# EasyEDA Pro project EasyEDA.epro

# Schematic Schematic1_1
Board Name: Board1_1; Create Date: 2025-07-24; Page Name: P1; Project Name: FM_Transmitter_V2; Schematic Name: Schematic1_1; Update Date: 2025-07-27; Company: EasyEDA.com; Page Size: A4; Version: V1.0
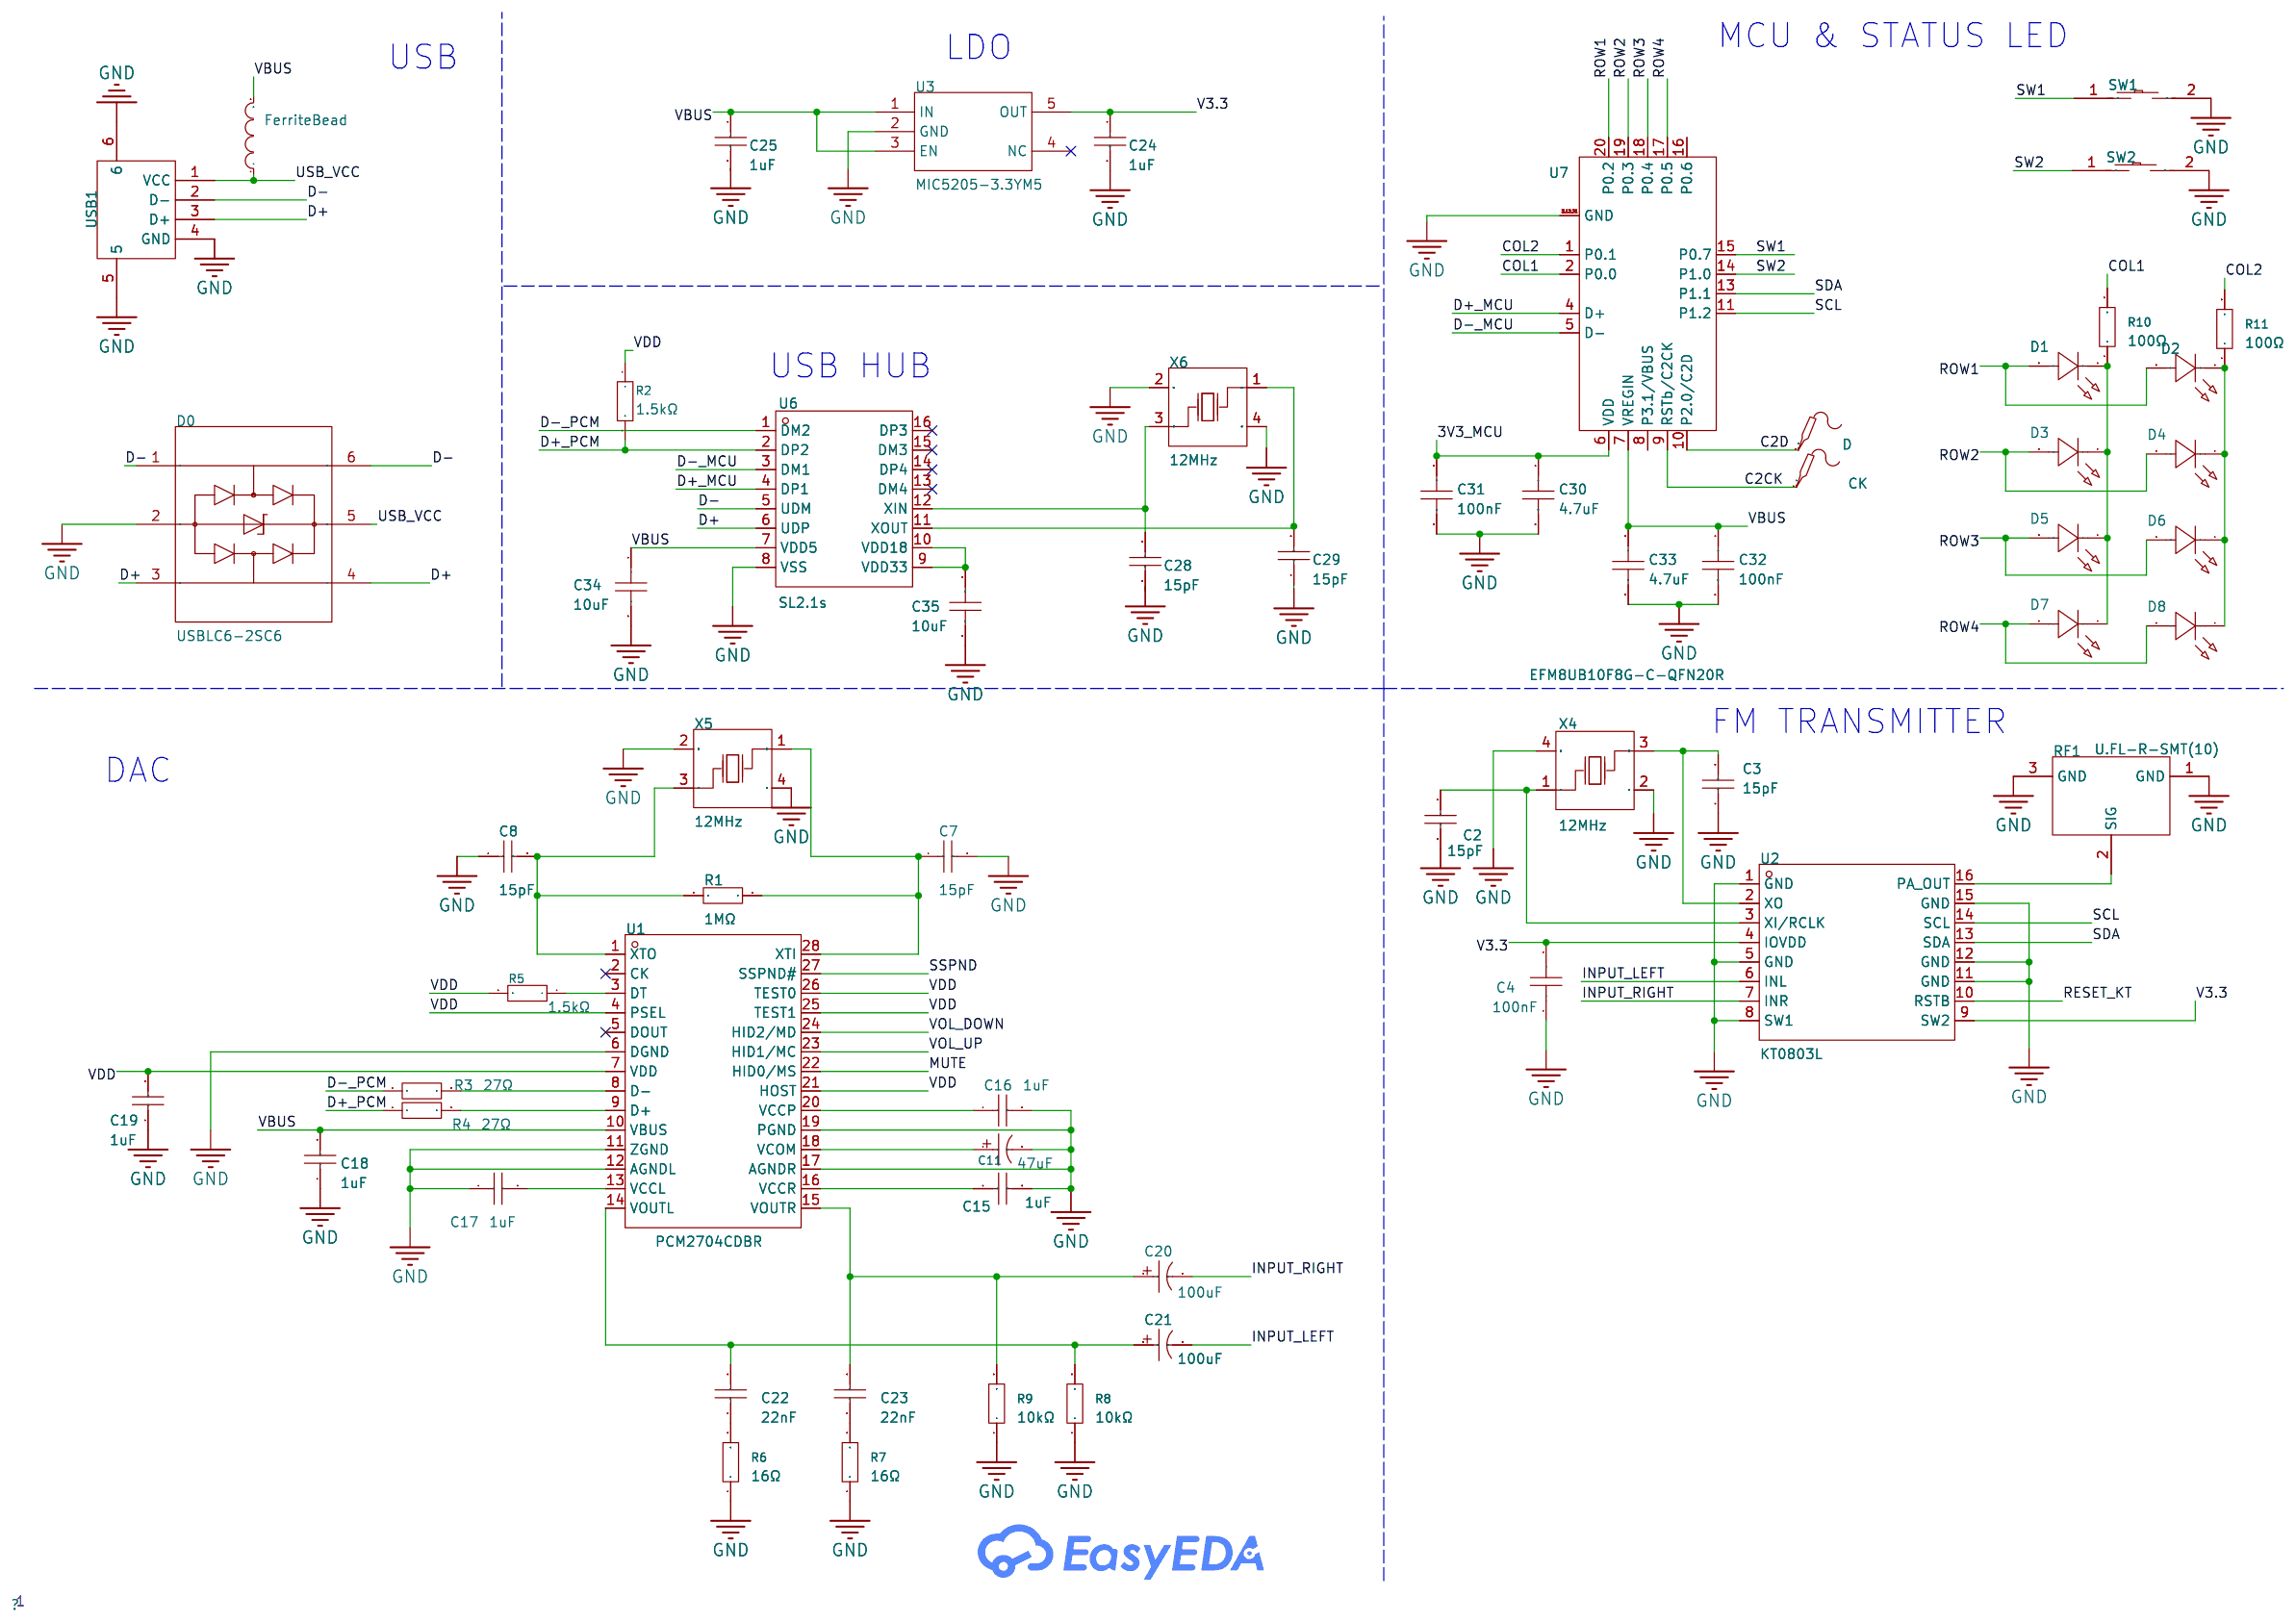
[diagram p0: schematic sheet]

## Parts
C2  15pF  [C0402]
C3  15pF  [C0402]
C4  100nF  [C0402]
C7  15pF  [C0402]
C8  15pF  [C0402]
C11  47uF  [CAP-SMD_BD5.0-L5.3-W5.3-FD]
C15  1uF  [C0402]
C16  1uF  [C0402]
C17  1uF  [C0402]
C18  1uF  [C0402]
C19  1uF  [C0402]
C20  100uF  [CAP-SMD_BD5.0-L5.3-W5.3-RD]
C21  100uF  [CAP-SMD_BD5.0-L5.3-W5.3-RD]
C22  22nF  [C0402]
C23  22nF  [C0402]
C24  1uF  [C0402]
C25  1uF  [C0402]
C28  15pF  [C0402]
C29  15pF  [C0402]
C30  4.7uF  [C0402]
C31  100nF  [C0402]
C32  100nF  [C0402]
C33  4.7uF  [C0402]
C34  10uF  [C0402]
C35  10uF  [C0402]
CK  -  [Test-Point-0.5mm]
D  -  [Test-Point-0.5mm]
D0  USBLC6-2SC6  [SOT-23-6_L2.9-W1.6-P0.95-LS2.8-BL]
D1  XL-1005UGC  [LED0402-RD_GREEN]
D2  XL-1005UGC  [LED0402-RD_GREEN]
D3  XL-1005UGC  [LED0402-RD_GREEN]
D4  XL-1005UGC  [LED0402-RD_GREEN]
D5  XL-1005UGC  [LED0402-RD_GREEN]
D6  XL-1005UGC  [LED0402-RD_GREEN]
D7  XL-1005UGC  [LED0402-RD_GREEN]
D8  XL-1005UGC  [LED0402-RD_GREEN]
FerriteBead  MPZ2012S601AT000  [L0805]
R1  1MΩ  [R0402]
R2  1.5kΩ  [R0402]
R3  27Ω  [R0402]
R4  27Ω  [R0402]
R5  1.5kΩ  [R0402]
R6  16Ω  [R0402]
R7  16Ω  [R0402]
R8  10kΩ  [R0402]
R9  10kΩ  [R0402]
R10  100Ω  [R0402]
R11  100Ω  [R0402]
RF1  U.FL-R-SMT(10)  [ANT-SMD_UFL-R-SMT01]
SW1  B3U-1000P  [KEY-SMD_B3U-1000PM]
SW2  B3U-1000P  [KEY-SMD_B3U-1000PM]
U1  PCM2704CDBR  [SSOP-28_L10.2-W5.3-P0.65-LS7.8-BL]
U2  KT0803L  [SOP-16_L9.9-W3.9-P1.27-LS6.0-BL]
U3  MIC5205-3.3YM5  [SOT-23-5_L2.9-W1.6-P0.95-LS2.8-BR]
U6  SL2.1s  [SSOP-16_L4.6-W2.6-P0.53-LS4.0-BL]
U7  EFM8UB10F8G-C-QFN20R  [QFN-20_L3.0-W3.0-P0.50-TL-EP1.7_SILICON_C8051F85X]
USB1  U-G-O4DD-W-1  [USB-A-TH_U-G-04WD-W-01]
X4  12MHz  [CRYSTAL-SMD_4P-L2.5-W2.0-BL-A]
X5  12MHz  [CRYSTAL-SMD_4P-L2.5-W2.0-BL-A]
X6  12MHz  [CRYSTAL-SMD_4P-L2.5-W2.0-BL-A]

## Library data of the parts
C2 C3 C7 C28 C29 = 0402CG150J500NT: Capacitance: Tolerance:±5% Tolerance:±5% Voltage Rated: Temperature Coefficient:; LCSC Part Name: 15pF ±5% 50V; Supplier Part: C1548; Manufacturer: FH(风华); Supplier Footprint: 0402; JLCPCB Part Class: Basic Part; Datasheet: https://atta.szlcsc.com/upload/public/pdf/source/20200305/C486355_26A10D38EF8C2A5C37091D0039909270.pdf; Supplier: LCSC; Tolerance: ±5%
C4 = CL05B104KO5NNNC: Capacitance: Tolerance:±10% Tolerance:±10% Voltage Rated: Temperature Coefficient:; LCSC Part Name: 100nF ±10% 16V; Supplier Part: C1525; Manufacturer: SAMSUNG(三星); Supplier Footprint: 0402; JLCPCB Part Class: Basic Part; Datasheet: https://atta.szlcsc.com/upload/public/pdf/source/20160218/1457707763339.pdf; Supplier: LCSC; Tolerance: ±10%
C8 = GJM1555C1H150FB01D: Capacitance: Tolerance:±1% Tolerance:±1% Voltage Rated: Temperature Coefficient:; LCSC Part Name: 15pF ±1% 50V; Supplier Part: C441742; Manufacturer: muRata(村田); Supplier Footprint: 0402; JLCPCB Part Class: Extended Part; Datasheet: https://atta.szlcsc.com/upload/public/pdf/source/20200305/C490387_23319AE8C154DEB24C505E6C82A8106A.pdf; Supplier: LCSC; Tolerance: ±1%
C11 = RVT1C470M0505: Capacitance: Tolerance:±20% Tolerance:±20% Rated Voltage: Ripple Current:- Equivalent Series Resistance(ESR):- φD: L: Lifetime @ Temp:2000hrs@105℃ Operating Temperature:-55℃~+105℃ Operating Temperature:-55℃~+105℃; LCSC Part Name: 47uF ±20% 16V; Supplier Part: C3337; Manufacturer: HONOR(荣誉); Supplier Footprint: SMD,D5xL5.4mm; JLCPCB Part Class: Extended Part; Datasheet: https://atta.szlcsc.com/upload/public/pdf/source/20170602/1496384426683.pdf; Supplier: LCSC; Tolerance: ±20%; Lifetime @ Temp: 2000hrs@105℃; Operating Temperature: -55℃~+105℃
C15-C19 C24 C25 = CL05A105KP5NNNC: Capacitance: Tolerance:±10% Tolerance:±10% Voltage Rated: Temperature Coefficient:; LCSC Part Name: 1uF ±10% 10V; Supplier Part: C14445; Manufacturer: SAMSUNG(三星); Supplier Footprint: 0402; JLCPCB Part Class: Extended Part; Datasheet: https://atta.szlcsc.com/upload/public/pdf/source/20160218/1457707763339.pdf; Supplier: LCSC; Tolerance: ±10%
C20 C21 = FVH010ADA101M0554: Capacitance:100uF Tolerance:±20% Tolerance:±20% Voltage Rating:10V Operating Temperature:-55℃~+105℃ Operating Temperature:-55℃~+105℃; LCSC Part Name: 100uF ±20% 10V 宽温品; Supplier Part: C7469983; Manufacturer: FOSAN(富捷/富信); Supplier Footprint: 5x5.4; JLCPCB Part Class: Extended Part; Datasheet: https://atta.szlcsc.com/upload/public/pdf/source/20230725/F0E937D26738F08AA89B969080CCF08D.pdf; Supplier: LCSC; Tolerance: ±20%; Voltage Rating: 10V; Operating Temperature: -55℃~+105℃
C22 C23 = 0402B223K500NT: Capacitance:22nF Tolerance:±10% Tolerance:±10% Voltage Rating:50V Temperature Coefficient:X7R; LCSC Part Name: 22nF ±10% 50V; Supplier Part: C1532; Manufacturer: FH(风华); Supplier Footprint: 0402; Datasheet: https://atta.szlcsc.com/upload/public/pdf/source/20200305/C486355_26A10D38EF8C2A5C37091D0039909270.pdf; Supplier: LCSC; Tolerance: ±10%; Voltage Rating: 50V; Temperature Coefficient: X7R
C30 C33 = CL05A475KP5NRNC: Capacitance: Tolerance:±10% Tolerance:±10% Voltage Rated: Temperature Coefficient:; LCSC Part Name: 4.7uF ±10% 10V; Supplier Part: C368809; Manufacturer: SAMSUNG(三星); Supplier Footprint: 0402; JLCPCB Part Class: Extended Part; Datasheet: https://atta.szlcsc.com/upload/public/pdf/source/20160218/1457707763339.pdf; Supplier: LCSC; Tolerance: ±10%
C31 C32 = CL05A104KA5NNNC: Capacitance: Tolerance:±10% Tolerance:±10% Voltage Rated: Temperature Coefficient:; LCSC Part Name: 100nF ±10% 25V; Supplier Part: C100072; Manufacturer: SAMSUNG(三星); Supplier Footprint: 0402; JLCPCB Part Class: Extended Part; Datasheet: https://atta.szlcsc.com/upload/public/pdf/source/20160218/1457707763339.pdf; Supplier: LCSC; Tolerance: ±10%
C34 C35 = CAP_0402: Supplier Part: C1525; Supplier Footprint: 0402
CK D = Test-Point: Test Point 测试点
D0 = USBLC6-2SC6: Reverse Stand-Off Voltage (Vrwm):5V Maximum Clamping Voltage:20V Peak Pulse Current (Ipp)@10/1000us:5A Breakdown Voltage:6V Type:ESD; LCSC Part Name: ESD二极管 USBLC6-2SC6; Supplier Part: C323793; Supplier Footprint: SOT-23-6; JLCPCB Part Class: Extended Part; Datasheet: https://atta.szlcsc.com/upload/public/pdf/source/20181029/C323793_48F7908330A3F84485333C8DC43F9E49.pdf; Supplier: LCSC; Reverse Stand-Off Voltage (Vrwm): 5V; Maximum Clamping Voltage: 20V; Peak Pulse Current (Ipp)@10/1000us: 5A; Breakdown Voltage: 6V; Type: ESD
D1-D8 = XL-1005UGC_C965793: Emitted Color:Emerald Forward Voltage (VF):3V Forward Voltage (VF):3V Power Dissipation:80mW Forward Current:25mA Dominant Wavelength:516nm~531nm Dominant Wavelength:516nm~531nm Peak Wavelength:531nm Lens Color:Colorless Transparent Lens Color Temperature; Supplier Part: C965793; Manufacturer: XINGLIGHT(成兴光); Supplier Footprint: 0402; JLCPCB Part Class: Extended Part; Datasheet: https://atta.szlcsc.com/upload/public/pdf/source/20201230/C965793_0CDDD21E721E0FD2A4CEAFDFDBC3C135.pdf; Supplier: LCSC; Emitted Color: Emerald; Forward Voltage (VF): 3V; Power Dissipation: 80mW; Forward Current: 25mA; Dominant Wavelength: 516nm~531nm; Peak Wavelength: 531nm; Lens Color: Colorless Transparent Lens; Luminous Intensity: 249mcd; Viewing Angle: 120°; Mounting Sytle: Positive Stick; Operating Temperature: -30℃~+85℃
FerriteBead = MPZ2012S601AT000: Impedance @ Frequency:600Ω@100MHz Tolerance:±25% Tolerance:±25% DC Resistance:100mΩ Current Rating:2A Circuits:1; LCSC Part Name: 单路 0805磁珠 阻抗600Ω@100MHz; Supplier Part: C21519; Manufacturer: TDK; Supplier Footprint: 0805; JLCPCB Part Class: Extended Part; Datasheet: https://atta.szlcsc.com/upload/public/pdf/source/20141219/1457707252380.pdf; Supplier: LCSC; Impedance @ Frequency: 600Ω@100MHz; Tolerance: ±25%; DC Resistance: 100mΩ; Current Rating: 2A; Circuits: 1
R1 = 0402WGF1004TCE: Type:Thick Film Resistors Resistance:1MΩ Tolerance:±1% Tolerance:±1% Power(Watts): Overload Voltage (Max): Temperature Coefficient:±100ppm/℃ Temperature Coefficient:±100ppm/℃ Operating Temperature Range:-55℃~+155℃ Operating Temperature Range:-55℃~+155℃; LCSC Part Name: 1MΩ ±1% 62.5mW 厚膜电阻; Supplier Part: C26083; Manufacturer: UNI-ROYAL(厚声); Supplier Footprint: 0402; JLCPCB Part Class: Basic Part; Datasheet: https://atta.szlcsc.com/upload/public/pdf/source/20200306/C422600_1E6D84923E4A46A82E41ADD87F860B5C.pdf; Supplier: LCSC; Type: Thick Film Resistors; Tolerance: ±1%; Temperature Coefficient: ±100ppm/℃; Operating Temperature Range: -55℃~+155℃
R2 R5 = 0402WGF1501TCE: Type:Thick Film Resistors Resistance:1.5kΩ Tolerance:±1% Tolerance:±1% Power(Watts): Overload Voltage (Max): Temperature Coefficient:±100ppm/℃ Temperature Coefficient:±100ppm/℃ Operating Temperature Range:-55℃~+155℃ Operating Temperature Range:-55℃~+155℃; LCSC Part Name: 1.5kΩ ±1% 62.5mW 厚膜电阻; Supplier Part: C25867; Manufacturer: UNI-ROYAL(厚声); Supplier Footprint: 0402; JLCPCB Part Class: Basic Part; Datasheet: https://atta.szlcsc.com/upload/public/pdf/source/20200306/C422600_1E6D84923E4A46A82E41ADD87F860B5C.pdf; Supplier: LCSC; Type: Thick Film Resistors; Tolerance: ±1%; Temperature Coefficient: ±100ppm/℃; Operating Temperature Range: -55℃~+155℃
R3 R4 = 0402WGF270JTCE: Type:Thick Film Resistors Resistance:27Ω Tolerance:±1% Tolerance:±1% Power(Watts): Overload Voltage (Max): Temperature Coefficient:±100ppm/℃ Temperature Coefficient:±100ppm/℃ Operating Temperature Range:-55℃~+155℃ Operating Temperature Range:-55℃~+155℃; LCSC Part Name: 27Ω ±1% 62.5mW 厚膜电阻; Supplier Part: C25100; Manufacturer: UNI-ROYAL(厚声); Supplier Footprint: 0402; JLCPCB Part Class: Extended Part; Datasheet: https://atta.szlcsc.com/upload/public/pdf/source/20200306/C422600_1E6D84923E4A46A82E41ADD87F860B5C.pdf; Supplier: LCSC; Type: Thick Film Resistors; Tolerance: ±1%; Temperature Coefficient: ±100ppm/℃; Operating Temperature Range: -55℃~+155℃
R6 R7 = FRC0402F16R0TS: Type:Thick Film Resistors Resistance: Tolerance:±1% Tolerance:±1% Power(Watts): Overload Voltage (Max): Temperature Coefficient:±100ppm/℃ Temperature Coefficient:±100ppm/℃ Operating Temperature Range:-55℃~+155℃ Operating Temperature Range:-55℃~+155℃; LCSC Part Name: 16Ω ±1% 62.5mW 厚膜电阻; Supplier Part: C2909324; Manufacturer: FOJAN(富捷); Supplier Footprint: 0402; JLCPCB Part Class: Extended Part; Datasheet: https://atta.szlcsc.com/upload/public/pdf/source/20211221/925EC7D7225764EE0046F22065062C87.pdf; Supplier: LCSC; Type: Thick Film Resistors; Tolerance: ±1%; Temperature Coefficient: ±100ppm/℃; Operating Temperature Range: -55℃~+155℃
R8 R9 = 0402WGJ0103TCE: Type:Thick Film Resistors Resistance:10kΩ Tolerance:±5% Tolerance:±5% Power(Watts): Overload Voltage (Max): Temperature Coefficient:±100ppm/℃ Temperature Coefficient:±100ppm/℃ Operating Temperature Range:-55℃~+155℃ Operating Temperature Range:-55℃~+155℃; LCSC Part Name: 10kΩ ±5% 62.5mW 厚膜电阻; Supplier Part: C25531; Manufacturer: UNI-ROYAL(厚声); Supplier Footprint: 0402; JLCPCB Part Class: Extended Part; Datasheet: https://atta.szlcsc.com/upload/public/pdf/source/20200306/C422600_1E6D84923E4A46A82E41ADD87F860B5C.pdf; Supplier: LCSC; Type: Thick Film Resistors; Tolerance: ±5%; Temperature Coefficient: ±100ppm/℃; Operating Temperature Range: -55℃~+155℃
R10 R11 = FRC0402F1000TS: Type:Thick Film Resistors Resistance: Tolerance:±1% Tolerance:±1% Power(Watts): Overload Voltage (Max): Temperature Coefficient:±100ppm/℃ Temperature Coefficient:±100ppm/℃ Operating Temperature Range:-55℃~+155℃ Operating Temperature Range:-55℃~+155℃; LCSC Part Name: 100Ω ±1% 62.5mW 厚膜电阻; Supplier Part: C2906860; Manufacturer: FOJAN(富捷); Supplier Footprint: 0402; JLCPCB Part Class: Extended Part; Datasheet: https://atta.szlcsc.com/upload/public/pdf/source/20211221/925EC7D7225764EE0046F22065062C87.pdf; Supplier: LCSC; Type: Thick Film Resistors; Tolerance: ±1%; Temperature Coefficient: ±100ppm/℃; Operating Temperature Range: -55℃~+155℃
RF1 = U.FL-R-SMT(10): Connector Type:板端 Interface Type:内针 Number of Ports:1 Interface Diameter:2mm Interface Length/Height:1.25mm Frequency-Max:6GHz RF Series:IPEX Impedance:50Ω Style:- Contact Material:Brass Operating Temperature Range:-40℃~+90℃ Operating Temperature Range:-4; LCSC Part Name: IPEX 内针; Supplier Part: C434808; Manufacturer: HRS(广濑); Supplier Footprint: SMD; JLCPCB Part Class: Extended Part; Datasheet: https://atta.szlcsc.com/upload/public/pdf/source/20191010/C434816_11DAC26C7ED37A2D3E584E7DBDF6972E.pdf; Supplier: LCSC; Connector Type: 板端; Interface Type: 内针; Number of Ports: 1; Interface Diameter: 2mm; Interface Length/Height: 1.25mm; Frequency-Max: 6GHz; RF Series: IPEX; Impedance: 50Ω; Contact Material: Brass; Operating Temperature Range: -40℃~+90℃
SW1 SW2 = B3U-1000P_C231329: Circuit:SPST Actuator Style:Round Button Operating Force:153gf Mounting Style:Standing paste Switch Length:3mm Switch Width:2.5mm Switch Height:1.6mm Contact Current:50mA Voltage Rating (DC):12V With Lamp:- Pin Style:SMDSplicing Mechanical Life:- Operatin; LCSC Part Name: 3*2.5*1.6mm 立贴 轻触开关; Supplier Part: C231329; Manufacturer: OMRON(欧姆龙); Supplier Footprint: SMD,2.5x3mm; JLCPCB Part Class: Extended Part; Supplier: LCSC; Circuit: SPST; Actuator Style: Round Button; Operating Force: 153gf; Mounting Style: Standing paste; Switch Length: 3mm; Switch Width: 2.5mm; Switch Height: 1.6mm; Contact Current: 50mA; Voltage Rating (DC): 12V; Pin Style: SMDSplicing; Operating Temperature: -25℃~+70℃
U1 = PCM2704CDBR: Resolution:16 Number of Channels:- Voltage - Supply:3V~5.25V Voltage - Supply:3V~5.25V Interface Type:USB；SPI Operating Temperature:-25℃~+85℃ Operating Temperature:-25℃~+85℃; Supplier Part: C2859784; Manufacturer: TI(德州仪器); Supplier Footprint: SSOP-28-208mil; JLCPCB Part Class: Extended Part; Datasheet: https://www.ti.com/cn/lit/gpn/pcm2706c; Supplier: LCSC; Resolution: 16; Voltage - Supply: 3V~5.25V; Interface Type: USB；SPI; Operating Temperature: -25℃~+85℃
U2 = KT0803L: Supplier Part: C9900105795; Supplier Footprint: SOP16; JLCPCB Part Class: Extended Part; Supplier: LCSC
U3 = MIC5205-3.3YM5: Output Type:Fixed Voltage - Supply:20V Output Voltage:3.3V Output Voltage:3.3V Output Current:150mA Power Supply Rejection Ratio (PSRR):70dB@(1kHz) Operating Temperature:-40℃~+125℃@(Tj) Operating Temperature:-40℃~+125℃@(Tj) Output Configuration:Positive e; LCSC Part Name: 线性稳压器(LDO); Supplier Part: C20617303; Manufacturer: TECH PUBLIC(台舟); Supplier Footprint: SOT-23-5; JLCPCB Part Class: Extended Part; Datasheet: https://atta.szlcsc.com/upload/public/pdf/source/20240202/BF02EA9B20BC582DB45A13FA3EA98D4D.pdf; Supplier: LCSC; Output Type: Fixed; Voltage - Supply: 20V; Output Voltage: 3.3V; Output Current: 150mA; Power Supply Rejection Ratio (PSRR): 70dB@(1kHz); Operating Temperature: -40℃~+125℃@(Tj); Output Configuration: Positive electrode; Number of Outputs: 1
U6 = SL2.1s: Supplier Part: C2684433; Manufacturer: CoreChips(和芯润德); Supplier Footprint: SSOP-16-2.6mm; Datasheet: https://atta.szlcsc.com/upload/public/pdf/source/20210326/C2684433_0308B0C984AD3FC6CBDA43F1CDB06B3F.pdf; Supplier: LCSC
U7 = EFM8UB10F8G-C-QFN20R: CPU Core:51Series Program Storage Size:8KB RAM Size:2.25KB GPIO Ports Number:13 Operating Voltage Range:1.71V~3.6V Operating Voltage Range:1.71V~3.6V CPU Maximum Speed:50MHz Program Memory Type:FLASH Operating Temperature Range:-40℃~+85℃ Operating Tempera; Supplier Part: C2055590; Manufacturer: SKYWORKS/SILICON LABS(芯科); Supplier Footprint: QFN-20-EP(3x3); Datasheet: https://atta.szlcsc.com/upload/public/pdf/source/20210702/AAB6029825307DEA1E2C140C782B19C1.pdf; Supplier: LCSC; CPU Core: 51Series; Program Storage Size: 8KB; RAM Size: 2.25KB; GPIO Ports Number: 13; Operating Voltage Range: 1.71V~3.6V; CPU Maximum Speed: 50MHz; Program Memory Type: FLASH; Operating Temperature Range: -40℃~+85℃; ADC (Bit): 12bit; Peripheral/Function: Watchdog; Watchdog: Yes; Internal Oscillator: Yes
USB1 = U-G-O4DD-W-1: Connector Type:Type-A Standard:USB 2.0 Gender:公 Number of Ports:1 Number of Contacts:4P Current Rating - Power (Max):1A; LCSC Part Name: Type-A 公; Supplier Part: C98125; Manufacturer: 韩国韩荣; Supplier Footprint: 插件; JLCPCB Part Class: Extended Part; Datasheet: https://atta.szlcsc.com/upload/public/pdf/source/20190321/C98125_6153EFB71EE46DEADFAFF2A82C946B59.pdf; Supplier: LCSC; Connector Type: Type-A; Standard: USB 2.0; Gender: 公; Number of Ports: 1; Number of Contacts: 4P; Current Rating - Power (Max): 1A
X4-X6 = SX2B12.000F1010F30: Type:Crystal Oscillator Frequency:12MHz Normal temperature Frequency Tolerance:±10ppm Normal temperature Frequency Tolerance:±10ppm Load Capacitance:10pF Frequency Stability:±30ppm Frequency Stability:±30ppm Equivalent Series Resistance(ESR):200Ω Operatin; LCSC Part Name: 12MHz ±10ppm 10pF; Supplier Part: C7301971; Manufacturer: SCTF(星通时频); Supplier Footprint: SMD2520-4P; JLCPCB Part Class: Extended Part; Datasheet: https://atta.szlcsc.com/upload/public/pdf/source/20240418/57769B85D7CD97C84A424B0AE31F5144.pdf; Supplier: LCSC; Type: Crystal Oscillator; Normal temperature Frequency Tolerance: ±10ppm; Load Capacitance: 10pF; Frequency Stability: ±30ppm; Equivalent Series Resistance(ESR): 200Ω; Operating Temperature: -40℃~+85℃

## Nets
3V3_MCU: C30.1 C31.1 U7.6(VDD)
GND: C2.1 C3.1 C4.1 C7.2 C8.1 C11.2 C15.2 C16.2 C17.1 C18.1 C19.1 C24.2 C25.2 C28.1 C29.1 C30.2 C31.2 C32.2 C33.2 C34.2 C35.2 D0.2 R6.1 R7.1 R8.1 R9.1 RF1.1(GND) RF1.3(GND) SW1.2 SW2.2 U1.6(DGND) U1.11(ZGND) U1.12(AGNDL) U1.17(AGNDR) U1.19(PGND) U2.1(GND) U2.5(GND) U2.8(SW1) U2.11(GND) U2.12(GND) U2.15(GND) U3.2(GND) U6.8(VSS) U7.3,12,21(GND) USB1.4(GND) USB1.5 USB1.6 X4.2(GND) X4.4(GND) X5.2(GND) X5.4(GND) X6.2(GND) X6.4(GND)
V3.3: C4.2 C24.1 U2.4(IOVDD) U2.9(SW2) U3.5(OUT)
VBUS: C18.2 C25.1 C32.1 C33.1 C34.1 FerriteBead.2 U1.10(VBUS) U3.1(IN) U3.3(EN) U6.7(VDD5) U7.7(VREGIN)
VDD: C19.2 R2.1 R5.2 U1.4(PSEL) U1.7(VDD) U1.21(HOST) U1.25(TEST1) U1.26(TEST0)
C2CK: CK.1 U7.9(RSTb/C2CK)
C2D: D.1 U7.10(P2.0/C2D)
COL1: R10.2 U7.2(P0.0)
COL2: R11.2 U7.1(P0.1)
D+: D0.3 D0.4 U6.6(UDP) USB1.3(D+)
D+_MCU: U6.4(DP1) U7.4(D+)
D+_PCM: R2.2 R4.1 U6.2(DP2)
D-: D0.1 D0.6 U6.5(UDM) USB1.2(D-)
D-_MCU: U6.3(DM1) U7.5(D-)
D-_PCM: R3.1 U6.1(DM2)
INPUT_LEFT: C21.2 U2.6(INL)
INPUT_RIGHT: C20.2 U2.7(INR)
MUTE: U1.22(HID0/MS)
RESET_KT: U2.10(RSTB)
ROW1: D1.2(A) D2.2(A) U7.20(P0.2)
ROW2: D3.2(A) D4.2(A) U7.19(P0.3)
ROW3: D5.2(A) D6.2(A) U7.18(P0.4)
ROW4: D7.2(A) D8.2(A) U7.17(P0.5)
SCL: U2.14(SCL) U7.11(P1.2)
SDA: U2.13(SDA) U7.13(P1.1)
SSPND: U1.27(SSPND#)
SW1: SW1.1 U7.15(P0.7)
SW2: SW2.1 U7.14(P1.0)
USB_VCC: D0.5 FerriteBead.1 USB1.1(VCC)
VOL_DOWN: U1.24(HID2/MD)
VOL_UP: U1.23(HID1/MC)
$1N1321: RF1.2(SIG) U2.16(PA_OUT)
$1N1861: C7.1 R1.2 U1.28(XTI) X5.1(OSC1)
$1N1867: C8.2 R1.1 U1.1(XTO) X5.3(OSC2)
$1N2251: C16.1 U1.20(VCCP)
$1N2376: C11.1 U1.18(VCOM)
$1N2424: C15.1 U1.16(VCCR)
$1N2491: C17.2 U1.13(VCCL)
$1N2905: R4.2 U1.9(D+)
$1N2912: R3.2 U1.8(D-)
$1N3054: R5.1 U1.3(DT)
$1N3574: C22.1 R6.2
$1N3613: C23.1 R7.2
$1N3658: C20.1 C23.2 R9.2 U1.15(VOUTR)
$1N3676: C21.1 C22.2 R8.2 U1.14(VOUTL)
$1N27902: C2.2 U2.3(XI/RCLK) X4.1(OSC1)
$1N27931: C3.2 U2.2(XO) X4.3(OSC2)
$1N27996: C29.2 U6.11(XOUT) X6.1(OSC1)
$1N28003: C28.2 U6.12(XIN) X6.3(OSC2)
$1N49869: D1.1(K) D3.1(K) D5.1(K) D7.1(K) R10.1
$1N49876: D2.1(K) D4.1(K) D6.1(K) D8.1(K) R11.1
$1N69021: C35.1 U6.9(VDD33) U6.10(VDD18)

Not connected (* = marked no-connect by the designer): U1 2(CK)* 5(DOUT)*; U3 4(NC)*; U6 13(DM4)* 14(DP4)* 15(DM3)* 16(DP3)*; U7 8(P3.1/VBUS) 16(P0.6)

## Notes on the sheet
- LDO
- MCU & STATUS LED
- USB
- USB HUB
- FM TRANSMITTER
- DAC

# Board PCB1_1
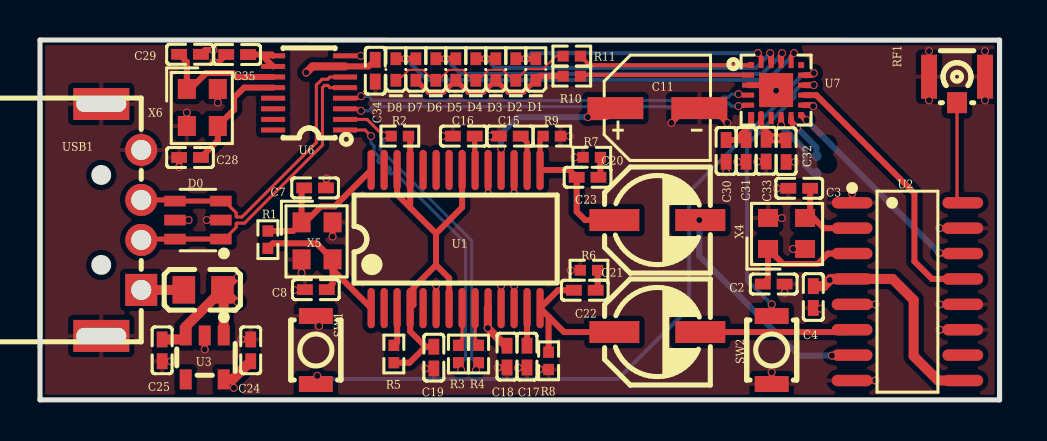
[diagram p1: board, top side]
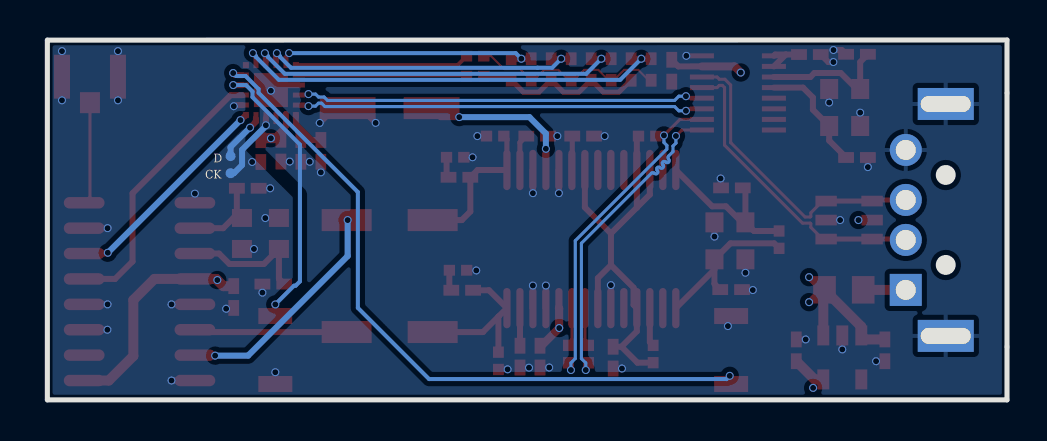
[diagram p2: board, bottom side, seen from below]

Outline 48 x 18 mm; copper layers: Top Layer, Inner1, Inner2, Bottom Layer. Coordinates in mm from the lower left corner of the outline.
Outline path: 0,15.35 0,18 48,17.99 48,0 0,0 0,2.65
Stack: Top Layer 0.035mm Outer layer thickness 1oz / Dielectric1 0.2104mm 7628 RC49% 8.6mil / Inner1 0.0152mm Inner layer thickness / Dielectric2 1.065mm 1.1mm H/HOZ Copper / Inner2 0.0152mm Inner layer thickness / Dielectric3 0.2104mm 7628 RC49% 8.6mil / Bottom Layer 0.035mm Outer layer thickness 1oz

## Design rules (mm)
net $1N2912: DP5
net $1N2905: DP5
net D-: DP1
net D+: DP1
net D+_PCM: DP3
net D-_PCM: DP3
net D-_MCU: DP4
net D+_MCU: DP4
template: Custom Config
spacing copperThickness1oz (default): track to track 0.102, other pairs 0.152 to 0.3
spacing copperThickness2oz: track to track 0.203, other pairs 0.152 to 0.3
track width copperThickness1oz: min 0.1, default 0.2, max 5
track width copperThickness2oz: min 0.203, default 0.254, max 2.54
track width trackWidth1 (default): min 0.1, default 0.3, max 2.54
differential pair differentialPair (default): width min 0.127, default 0.155, max 2.54; gap min 0.152, default 0.152
via viaSize (default): diameter min 0.4, default 0.4, max 10; hole min 0.3, default 0.3, max 6.3

## Placement (name value [footprint] x y rotation side)
C2  15pF  [C0402]  36.7 5.79 180 top
C3  15pF  [C0402]  37.98 10.58 0 top
C4  100nF  [C0402]  38.68 5.14 90 top
C7  15pF  [C0402]  13.76 10.6 0 top
C8  15pF  [C0402]  13.8 5.51 0 top
C11  47uF  [CAP-SMD_BD5.0-L5.3-W5.3-FD]  30.88 14.59 0 top
C15  1uF  [C0402]  23.5 13.19 180 top
C16  1uF  [C0402]  21.2 13.19 180 top
C17  1uF  [C0402]  24.36 2.16 90 top
C18  1uF  [C0402]  23.36 2.16 90 top
C19  1uF  [C0402]  19.7 2.11 90 top
C20  100uF  [CAP-SMD_BD5.0-L5.3-W5.3-RD]  30.88 8.99 180 top
C21  100uF  [CAP-SMD_BD5.0-L5.3-W5.3-RD]  30.88 3.39 180 top
C22  22nF  [C0402]  27.25 5.48 180 top
C23  22nF  [C0402]  27.39 11.13 180 top
C24  1uF  [C0402]  10.54 2.48 90 top
C25  1uF  [C0402]  6.11 2.48 270 top
C28  15pF  [C0402]  7.5 12.12 0 top
C29  15pF  [C0402]  7.5 17.28 180 top
C30  4.7uF  [C0402]  34.32 12.45 270 top
C31  100nF  [C0402]  35.32 12.45 270 top
C32  100nF  [C0402]  37.32 12.44 270 top
C33  4.7uF  [C0402]  36.32 12.46 270 top
C34  10uF  [C0402]  16.77 16.46 270 top
C35  10uF  [C0402]  9.86 17.27 180 top
CK  -  [Test-Point-0.5mm]  38.84 11.34 180 bottom
D  -  [Test-Point-0.5mm]  38.84 12.19 180 bottom
D0  USBLC6-2SC6  [SOT-23-6_L2.9-W1.6-P0.95-LS2.8-BL]  7.9 8.99 90 top
D1  XL-1005UGC  [LED0402-RD_GREEN]  24.8 16.52 90 top
D2  XL-1005UGC  [LED0402-RD_GREEN]  23.8 16.52 90 top
D3  XL-1005UGC  [LED0402-RD_GREEN]  22.8 16.52 90 top
D4  XL-1005UGC  [LED0402-RD_GREEN]  21.8 16.52 90 top
D5  XL-1005UGC  [LED0402-RD_GREEN]  20.8 16.52 90 top
D6  XL-1005UGC  [LED0402-RD_GREEN]  19.8 16.52 90 top
D7  XL-1005UGC  [LED0402-RD_GREEN]  18.8 16.52 90 top
D8  XL-1005UGC  [LED0402-RD_GREEN]  17.8 16.52 90 top
FerriteBead  MPZ2012S601AT000  [L0805]  8.16 5.5 0 top
R1  1MΩ  [R0402]  11.4 8.01 90 top
R2  1.5kΩ  [R0402]  18 13.19 180 top
R3  27Ω  [R0402]  20.93 2.29 90 top
R4  27Ω  [R0402]  21.94 2.29 90 top
R5  1.5kΩ  [R0402]  17.7 2.29 270 top
R6  16Ω  [R0402]  27.46 6.48 0 top
R7  16Ω  [R0402]  27.6 12.13 0 top
R8  10kΩ  [R0402]  25.44 1.95 90 top
R9  10kΩ  [R0402]  25.6 13.19 180 top
R10  100Ω  [R0402]  26.6 16.19 0 top
R11  100Ω  [R0402]  26.6 17.19 0 top
RF1  U.FL-R-SMT(10)  [ANT-SMD_UFL-R-SMT01]  45.87 15.51 180 top
SW1  B3U-1000P  [KEY-SMD_B3U-1000PM]  13.8 2.49 90 top
SW2  B3U-1000P  [KEY-SMD_B3U-1000PM]  36.6 2.49 270 top
U1  PCM2704CDBR  [SSOP-28_L10.2-W5.3-P0.65-LS7.8-BL]  20.79 8.04 0 top
U2  KT0803L  [SOP-16_L9.9-W3.9-P1.27-LS6.0-BL]  43.39 5.41 270 top
U3  MIC5205-3.3YM5  [SOT-23-5_L2.9-W1.6-P0.95-LS2.8-BR]  8.24 2.12 90 top
U6  SL2.1s  [SSOP-16_L4.6-W2.6-P0.53-LS4.0-BL]  13.46 15.35 90 top
U7  EFM8UB10F8G-C-QFN20R  [QFN-20_L3.0-W3.0-P0.50-TL-EP1.7_SILICON_C8051F85X]  36.82 15.49 0 top
USB1  U-G-O4DD-W-1  [USB-A-TH_U-G-04WD-W-01]  4.06 9 270 top
X4  12MHz  [CRYSTAL-SMD_4P-L2.5-W2.0-BL-A]  37.34 8.32 0 top
X5  12MHz  [CRYSTAL-SMD_4P-L2.5-W2.0-BL-A]  13.86 7.95 270 top
X6  12MHz  [CRYSTAL-SMD_4P-L2.5-W2.0-BL-A]  8.12 14.62 270 top

## Footprints (pads in the part's own frame, mm; a bottom-side part is the same pattern mirrored in y, then rotated)
ANT-SMD_UFL-R-SMT01
  rect 0.8x2.2 smd: 1(-1.4,-0.65) 3(1.4,-0.65)
  rect 1x1.05 smd: 2(0,0.65)
C0402
  rect 0.79x0.54 smd: 1(-0.545,0) 2(0.545,0)
CAP-SMD_BD5.0-L5.3-W5.3-FD
  rect 2.8x1.1 smd: 1(-2.1,0) 2(2.1,0)
CAP-SMD_BD5.0-L5.3-W5.3-RD
  rect 2.5x1.1 smd: 1(2.15,0) 2(-2.15,0)
CRYSTAL-SMD_4P-L2.5-W2.0-BL-A
  rect 1x0.9 smd: 1(-0.925,-0.775) 2(0.925,-0.775) 3(0.925,0.775) 4(-0.925,0.775)
KEY-SMD_B3U-1000PM
  rect 0.8x1.7 smd: 1(-1.7,0) 2(1.7,0)
L0805
  rect 1.133x1.377 smd: 1(-0.966,0) 2(0.966,0)
LED0402-RD_GREEN
  rect 0.636x0.54 smd: 1(-0.538,0) 2(0.538,0)
QFN-20_L3.0-W3.0-P0.50-TL-EP1.7_SILICON_C8051F85X
  rect 0.3x0.3 smd: 1(-1.25,1.25) 6(-1.25,-1.25) 11(1.25,-1.25) 16(1.25,1.25)
  rect 0.6x0.25 smd: 2(-1.4,0.75) 3(-1.4,0.25) 4(-1.4,-0.25) 5(-1.4,-0.75) 12(1.4,-0.75) 13(1.4,-0.25) 14(1.4,0.25) 15(1.4,0.75)
  rect 0.25x0.6 smd: 7(-0.75,-1.4) 8(-0.25,-1.4) 9(0.25,-1.4) 10(0.75,-1.4) 17(0.75,1.4) 18(0.25,1.4) 19(-0.25,1.4) 20(-0.75,1.4)
  rect 1.7x1.7 smd: 21(-0.001,0)
R0402
  rect 0.566x0.54 smd: 1(-0.433,0) 2(0.433,0)
SOP-16_L9.9-W3.9-P1.27-LS6.0-BL
  oval 0.574x2.038 smd: 1(-4.445,-2.769) 2(-3.175,-2.769) 3(-1.905,-2.769) 4(-0.635,-2.769) 5(0.635,-2.769) 6(1.905,-2.769) 7(3.175,-2.769) 8(4.445,-2.769) 9(4.445,2.769) 10(3.175,2.769) 11(1.905,2.769) 12(0.635,2.769) 13(-0.635,2.769) 14(-1.905,2.769) 15(-3.175,2.769) 16(-4.445,2.769)
SOT-23-5_L2.9-W1.6-P0.95-LS2.8-BR
  rect 1x0.6 smd: 1(1.1,-0.95) 2(1.1,0) 3(1.1,0.95) 4(-1.1,0.95) 5(-1.1,-0.95)
SOT-23-6_L2.9-W1.6-P0.95-LS2.8-BL
  rect 0.532x1.072 smd: 1(-0.95,-1.149) 2(0,-1.149) 3(0.95,-1.149) 4(0.95,1.149) 5(0,1.149) 6(-0.95,1.149)
SSOP-16_L4.6-W2.6-P0.53-LS4.0-BL
  rect 0.25x1.2 smd: 1(-1.855,-1.8) 2(-1.325,-1.8) 3(-0.795,-1.8) 4(-0.265,-1.8) 5(0.265,-1.8) 6(0.795,-1.8) 7(1.325,-1.8) 8(1.855,-1.8) 9(1.855,1.8) 10(1.325,1.8) 11(0.795,1.8) 12(0.265,1.8) 13(-0.265,1.8) 14(-0.795,1.8) 15(-1.325,1.8) 16(-1.855,1.8)
SSOP-28_L10.2-W5.3-P0.65-LS7.8-BL
  oval 0.364x2.015 smd: 1(-4.225,-3.455) 2(-3.575,-3.455) 3(-2.925,-3.455) 4(-2.275,-3.455) 5(-1.625,-3.455) 6(-0.975,-3.455) 7(-0.325,-3.455) 8(0.325,-3.455) 9(0.975,-3.455) 10(1.625,-3.455) 11(2.275,-3.455) 12(2.925,-3.455) 13(3.575,-3.455) 14(4.225,-3.455) 15(4.225,3.455) 16(3.575,3.455) 17(2.925,3.455) 18(2.275,3.455) 19(1.625,3.455) 20(0.975,3.455) 21(0.325,3.455) 22(-0.325,3.455) 23(-0.975,3.455) 24(-1.625,3.455) 25(-2.275,3.455) 26(-2.925,3.455) 27(-3.575,3.455) 28(-4.225,3.455)
Test-Point-0.5mm
  round 0.5 smd: 1(0,0)
USB-A-TH_U-G-04WD-W-01
  rect 1.6x1.6 hole 1: 1(3.5,1)
  round 1.6 hole 1: 2(1,1) 3(-1,1) 4(-3.5,1)
  rect 1.6x2.8 hole 0.8x2.5: 5(5.8,-1) 6(-5.8,-1)

## Nets
As in the schematic, except:
GND: C2.1 C3.1 C4.1 C7.2 C8.1 C11.2 C15.2 C16.2 C17.1 C18.1 C19.1 C24.2 C25.2 C28.1 C29.1 C30.2 C31.2 C32.2 C33.2 C34.2 C35.2 D0.2 R6.1 R7.1 R8.1 R9.1 RF1.1 RF1.3 SW1.2 SW2.2 U1.6 U1.11 U1.12 U1.17 U1.19 U2.1 U2.5 U2.8 U2.11 U2.12 U2.15 U3.2 U6.8 U7.3 U7.12 U7.21 USB1.4 USB1.5 USB1.6 X4.2 X4.4 X5.2 X5.4 X6.2 X6.4

Pads without a net: U1 2 5; U3 4; U6 13 14 15 16; U7 8 16

## Via types
v1: diameter 0.4, hole 0.3, Top Layer to Bottom Layer, 89 vias

## Routing (per net, layer and track width the routed paths; a pad name or vN(x,y) marks a point on that pad's centre or on a via; arc(x,y) is an arc through that point)
3V3_MCU: length 2.6
  Top Layer w0.299: 34.79,13 C31.1 ; 34.79,13 C30.1 ; 34.79,13 35.57,13.78 U7.6
GND: length 34.3
  Top Layer w0.3: C30.2 v1(34.32,11.38) ; C17.1 24.35,1.61 v1(23.91,1.61) ; U7.3 36.57,15.74 U7.21 ; v1(14.32,11.07) 14.32,10.62 C7.2 ; v1(12.72,5.49) 13.24,5.49 C8.1 ; C32.2 v1(37.76,11.9) ; X5.4 v1(14.63,8.17) ; R8.1 25.43,1.53 v1(24.98,1.53) ; v1(45,3.51) U2.11 ; SW2.2 v1(36.6,1.38) ; v1(40.62,10.32) U2.1 ; v1(19.81,5.74) U1.6 ; v1(19.26,1.57) C19.1 ; R9.1 v1(26.49,13.19) ; v1(38.68,14.69) 38.62,14.74 U7.12 ; X4.4 37.09,9.1 v1(37.1,9.09) ; v1(23.72,5.72) U1.12 ; v1(44.99,4.78) U2.12 ; v1(31.58,13.85) 32.32,14.59 C11.2 33.64,14.59 v1(34.38,13.85) ; v1(8.9,14.87) 8.9,15.55 X6.4 ; U1.17 v1(23.72,10.34) ; C35.2 8.94,16.9 v1(8.68,16.9) ; U3.2 v1(8.24,2.52) ; C28.1 v1(6.96,11.64) ; 38.27,7.55 v1(37.67,7.55) ; U1.19 v1(22.41,10.34) ; U2.8 v1(41.79,0.97) ; C31.2 v1(34.88,11.91) ; v1(22.49,13.19) C15.2 ; X5.2 v1(13.08,6.36) ; v1(8.35,8.99) D0.2 ; C33.2 v1(35.88,11.92) ; v1(20.12,13.19) C16.2 ; v1(10.07,3.02) C24.2 ; R7.1 v1(26.73,12.13) ; C25.2 v1(6.55,1.93) ; C2.1 v1(37.25,5.36) ; v1(22.9,1.62) C18.1 ; C29.1 8.27,17.5 v1(8.68,17.5) ; v1(23.06,5.72) U1.11 ; C4.1 39.02,4.6 v1(39.06,4.56) ; v1(36.86,10.58) C3.1 ; v1(7.34,14.37) 7.34,13.7 ; v1(44.99,8.59) U2.15 ; U2.5 v1(41.79,4.78)
  vias: v1(13.96,3.69) v1(16.04,17.21) v1(26.55,6.47) v1(36.82,15.46) v1(44.47,17.44) v1(44.47,14.98) v1(47.27,17.44) v1(47.27,14.98)
V3.3: length 45.1
  Top Layer w0.5: C4.2 39.19,5.69 v1(39.5,5.99) 39.56,6.05 U2.4 42.65,6.05 43.7,4.99 43.7,2.19 44.93,0.97 U2.9 ; C24.1 9.63,1.02 U3.5
  Inner2 w0.5: v1(9.7,0.6) 34.11,0.6 v1(39.5,5.99)
VBUS: length 64.7
  Top Layer w0.3: 9.27,5.5 v1(9.9,6.14) ; 9.27,5.5 FerriteBead.2 ; 9.27,5.5 9.29,5.5 v1(9.9,4.89) ; 36.68,13.08 36.07,13.69 36.07,14.3 ; U6.7 16.44,16.68 C34.1
  Top Layer w0.4: U6.7 13.62,16.68 v1(13.32,16.37) ; C18.2 23.28,2.71 v1(22.4,3.59) 22.4,4.57 U1.10
  Top Layer w0.5: C33.1 36.4,13.08 36.68,13.08 ; C25.1 7.09,3.02 U3.3 7.29,3.67 FerriteBead.2 9.19,5.44 U3.1 ; v1(36.82,13.08) 37.22,13.08 C32.1
  Inner2 w0.5: v1(9.9,4.89) 12.5,2.29 22.15,2.29 22.4,2.55 v1(22.4,3.59) 22.4,7.19 25.4,10.19 35.5,10.19 36.82,11.51 v1(36.82,13.08) ; v1(13.32,16.37) 13.32,13.11 9.9,9.69 v1(9.9,6.14)
VDD: length 22.6
  Top Layer w0.3: 18.51,9.62 U1.25 18.51,13.11 R2.1 ; 18.51,9.62 17.87,10.27 U1.26 ; 18.51,9.62 19.81,8.32 ; U1.7 20.47,6.09 19.81,6.74 ; 19.28,2.66 18.51,3.43 U1.4 18.68,4.75 18.68,5.61 19.81,6.74 ; 19.28,2.66 C19.2 ; 19.28,2.66 18.49,1.86 17.7,1.86 ; 19.81,8.32 21.12,9.63 21.12,11.5 ; 19.81,8.32 19.81,6.74
C2CK: length 3.6
  Top Layer w0.3: U7.9 v1(37.07,13.73)
  Bottom Layer w0.3: v1(37.07,13.73) 37.07,13.7 38.26,12.51 38.26,11.74 38.67,11.34 CK.1
C2D: length 2.4
  Top Layer w0.3: v1(37.87,13.62) 37.57,13.91 37.57,13.94 37.57,13.94 U7.10
  Bottom Layer w0.3: D.1 38.84,12.64 v1(37.87,13.62)
COL1: length 8.4
  Top Layer w0.201: U7.2 27.08,16.24 R10.2
COL2: length 8.7
  Top Layer w0.201: U7.1 27.48,16.74 R11.2
D+: length 15.2
  Top Layer w0.154: D0.3 9.23,9.94 9.81,9.35 9.81,9.18 9.85,9.15 10.1,9.15 13.82,12.87 13.82,15.75 14.11,16.04 14.39,16.04 14.51,16.15 U6.6
  Top Layer w0.254: D0.3 D0.4 6.69,10 USB1.3
D+_MCU: length 20.4
  Top Layer w0.154: U7.4 34.99,15.24 v1(34.94,15.29) ; v1(16.06,15.19) 15.96,15.09 U6.4
  Bottom Layer w0.154: v1(34.94,15.29) 34.59,15.29 34.44,15.15 34.16,15.15 33.99,14.98 16.63,14.98 16.41,15.19 v1(16.06,15.19)
D+_PCM: length 16
  Top Layer w0.154: v1(17.16,13.23) 16.36,14.03 U6.2
  Bottom Layer w0.155: v1(17.16,13.23) 17.16,12.87 17.01,12.73 17.01,12.54 21.59,7.96 21.59,2.07 21.81,1.85 v1(21.81,1.49)
D-: length 15.2
  Top Layer w0.154: U6.5 14.51,15.62 14.39,15.73 14.24,15.73 14.13,15.62 14.13,12.74 10.23,8.84 9.85,8.84 9.81,8.81 9.81,8.63 9.23,8.04 D0.1
  Top Layer w0.254: D0.1 D0.6 5.28,8.04 5.23,8 USB1.2
D-_MCU: length 20.4
  Top Layer w0.154: U6.3 15.96,14.56 v1(16.06,14.46) ; v1(34.94,14.69) 35.37,14.69 U7.5
  Bottom Layer w0.154: v1(16.06,14.46) 16.41,14.46 16.63,14.67 34.11,14.67 34.28,14.84 34.44,14.84 34.59,14.69 v1(34.94,14.69)
D-_PCM: length 16
  Top Layer w0.154: U6.1 16.26,13.5 v1(16.56,13.2)
  Bottom Layer w0.155: v1(16.56,13.2) 16.56,12.84 16.71,12.7 16.71,12.41 16.94,12.19 arc(16.97,12.11) 16.94,12.04 16.92,12.03 arc(16.92,11.89) 17.06,11.89 17.08,11.9 arc(17.22,11.9) 17.22,11.76 17.21,11.75 arc(17.21,11.61) 17.35,11.61 17.36,11.62 arc(17.5,11.62) 17.5,11.48 17.49,11.47 arc(17.49,11.32) 17.63,11.32 17.64,11.34 arc(17.71,11.37) 17.78,11.34 21.29,7.83 21.29,2.07 21.07,1.85 v1(21.07,1.49)
INPUT_LEFT: length 7.7
  Top Layer w0.3: U2.6 40.51,3.39 32.98,3.39
INPUT_RIGHT: length 10.5
  Bottom Layer w0.3: v1(39.61,2.21) 37.96,2.21 32.98,7.19 v1(32.98,8.99)
ROW1: length 13
  Top Layer w0.201: U7.20 36.07,17.15
  Top Layer w0.3: 23.8,17.06 v1(24.29,17.06) 24.8,17.06
  Bottom Layer w0.201: v1(35.91,17.34) 24.57,17.34 v1(24.29,17.06)
ROW2: length 16.2
  Top Layer w0.3: 22.8,17.06 v1(22.3,17.06) 21.8,17.06 ; v1(36.52,17.34) 36.57,17.29 U7.19
  Bottom Layer w0.201: v1(36.52,17.34) 36.36,17.19 36.36,17.16 35.82,16.61 23.49,16.61 23.48,16.61 22.75,16.61 v1(22.3,17.06)
ROW3: length 19.1
  Top Layer w0.3: 19.8,17.06 v1(20.29,17.06) 20.8,17.06 ; U7.18 37.07,17.29 v1(37.12,17.34)
  Bottom Layer w0.201: v1(37.12,17.34) 36.97,17.2 36.97,17.16 36.12,16.31 21.05,16.31 v1(20.29,17.06)
ROW4: length 22
  Top Layer w0.201: v1(37.72,17.34) 37.57,17.2 37.57,17.16 37.57,17.15 U7.17
  Top Layer w0.3: 17.8,17.06 v1(18.29,17.06) 18.8,17.06
  Bottom Layer w0.201: v1(18.29,17.06) 19.35,16 36.42,16 37.57,17.16 37.57,17.2 v1(37.72,17.34)
SCL: length 11
  Top Layer w0.3: U2.14 45.02,7.32 v1(44.98,7.36) ; v1(38.34,13.99) 38.32,13.99 U7.11
  Bottom Layer w0.3: v1(38.34,13.99) 44.98,7.36 v1(44.98,7.36)
SDA: length 13.7
  Top Layer w0.3: U2.13 44.62,6.05 43.74,6.92 43.74,10.33 38.83,15.24 U7.13
SW1: length 35.3
  Top Layer w0.3: U7.15 38.49,16.24 38.5,16.25 38.61,16.25 v1(38.71,16.35)
  Bottom Layer w0.201: v1(38.71,16.35) 38.56,16.2 38.09,16.2 37.44,15.55 37.44,15.36 32.47,10.39 32.47,4.6 28.91,1.04 14.03,1.04 v1(13.87,1.2)
SW2: length 14.4
  Top Layer w0.3: U7.14 38.7,15.74 v1(38.7,15.75) ; SW2.1 v1(36.6,4.77)
  Bottom Layer w0.2: v1(38.7,15.75) 38.06,15.75 37.74,15.42 37.74,15.14 35.37,12.77 35.37,5.92 35.58,5.71 35.66,5.71 v1(36.6,4.77)
USB_VCC: length 6.6
  Top Layer w0.5: USB1.1 7.19,5.5 FerriteBead.1
  Inner2 w0.3: v1(7.43,8.99) 7.43,7.87 USB1.1
$1N1321: length 5.1
  Top Layer w0.157: U2.16 45.87,10.15 RF1.2
$1N1861: length 8.2
  Top Layer w0.299: R1.2 12.65,8.45 X5.1 ; C7.1 13.08,10.47 X5.1 ; X5.1 13.26,8.88 14.06,9.68 14.75,9.68 U1.28
$1N1867: length 8
  Top Layer w0.299: 14.63,6.52 X5.3 13.83,7.83 11.65,7.83 11.4,7.58 ; 14.63,6.52 U1.1 ; 14.63,6.52 14.63,5.8 C8.2
$1N2251: length 1.7
  Top Layer w0.254: U1.20 21.75,11.52 C16.1
$1N2376: length 7
  Top Layer w0.3: C11.1 28.33,14.14 v1(27.4,14.14)
  Bottom Layer w0.3: v1(27.4,14.14) 23.89,14.14 23.06,13.32 v1(23.06,12.56)
$1N2424: length 1.8
  Top Layer w0.254: U1.16 24.37,12.87 C15.1
$1N2491: length 1.9
  Top Layer w0.3: U1.13 24.36,4.58 C17.2
$1N2905: length 1.9
  Top Layer w0.154: U1.9 21.76,3.03 21.94,2.85 R4.2
$1N2912: length 1.9
  Top Layer w0.154: R3.2 20.93,2.85 21.12,3.04 21.12,4.59
$1N3054: length 1.9
  Top Layer w0.3: R5.1 17.87,2.89 U1.3
$1N3574: length 1
  Top Layer w0.3: C22.1 27.89,5.58 R6.2
$1N3613: length 1
  Top Layer w0.3: 27.94,11.13 28.03,11.23 R7.2
$1N3658: length 7.6
  Top Layer w0.254: U1.15 25.01,13.04 R9.2
  Top Layer w0.3: U1.15 26.48,11.5 C23.2 26.84,9.42 27.27,8.99 28.78,8.99
$1N3676: length 8.1
  Top Layer w0.3: 25.44,4.16 26.21,3.39 28.78,3.39 ; 25.44,4.16 25.44,2.39 ; 25.44,4.16 U1.14 25.91,5.48 C22.2
$1N27902: length 6.6
  Top Layer w0.3: C2.2 36.42,6.06 36.42,7.55 37.17,6.8 38.89,6.8 39.41,7.32 U2.3
$1N27931: length 4.2
  Top Layer w0.3: 38.52,10.58 38.52,9.35 X4.3 38.69,9.1 39.21,8.59 U2.2
$1N27996: length 6.6
  Top Layer w0.3: U6.11 9.84,16.15 9.63,16.35 8.32,16.35 7.52,15.55 X6.1 7.34,16.9 C29.2
$1N28003: length 5.8
  Top Layer w0.3: C28.2 8.89,12.97 8.89,13.7 9.71,14.51 9.71,15.12 10.21,15.62 U6.12
$1N49869: length 8.9
  Top Layer w0.254: 24.78,15.99 24.19,15.39 23.41,15.39 22.82,15.99 D3.1 22.78,15.99 22.19,15.39 21.41,15.39 20.82,15.99 D5.1 20.78,15.99 20.19,15.39 19.41,15.39 18.82,15.99 D7.1
  Top Layer w0.3: D1.1 25.01,16.19 R10.1
$1N49876: length 10.2
  Top Layer w0.1: R11.1 25.8,17.19 25.15,16.54 24.36,16.54 D2.1 23.67,15.99 23.15,16.51 22.45,16.51 21.93,15.99 D4.1 21.67,15.99 21.15,16.51 20.45,16.51 19.93,15.99 D6.1 19.67,15.99 19.15,16.51 18.45,16.51 17.93,15.99 D8.1
$1N69021: length 2.1
  Top Layer w0.3: 11.06,17.27 C35.1 ; 11.06,17.27 U6.10 ; 11.06,17.27 11.59,17.27 U6.9

## Copper pours and planes (outline as drawn; the poured copper is in the pictures)
GND on Top Layer: 0,18 48,18 48,0 0,0
GND on Bottom Layer: 0,18 48,18 48,0 0,0
GND on Inner1: 0,18 48,18 48,0 0,0
GND on Inner2: 0,18 48,18 48,0 0,0
